# Altium project Transmitter.PrjPcb
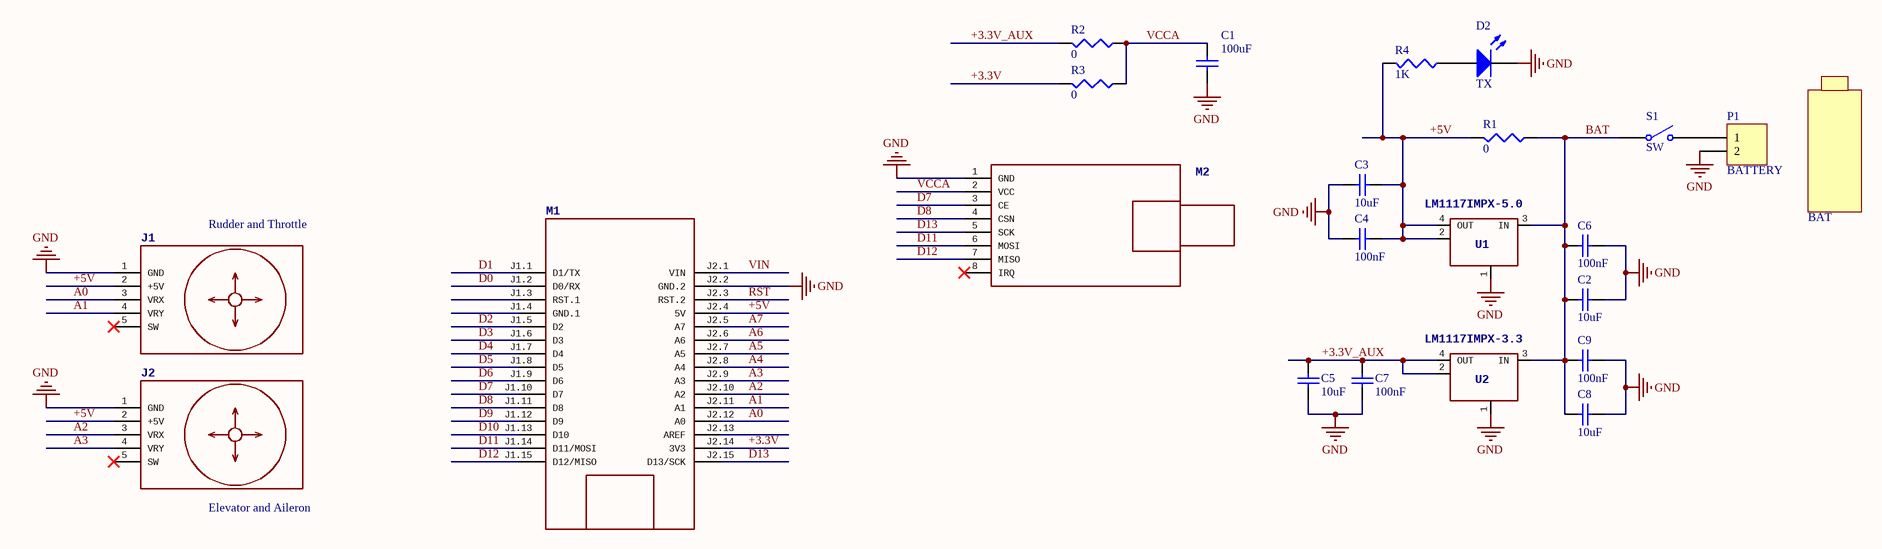
[diagram p0: Transmitter.SchDoc]
1 sheet, 23 parts. Net scope: global (net labels, ports and power ports of the same name join across sheets).
Board file: Transmitter.PcbDoc

## Sheet Transmitter.SchDoc
size A3

### Parts
BAT  BAT  [BAT]  (value not drawn)
C1  value 100uF  [CAPR5-4X5]  (hidden comment: Cap)
C2  value 10uF  [R1206]  (hidden comment: Cap)
C3  value 10uF  [R1206]  (hidden comment: Cap)
C4  value 100nF  [R1206]  (hidden comment: Cap)
C5  value 10uF  [R1206]  (hidden comment: Cap)
C6  value 100nF  [R1206]  (hidden comment: Cap)
C7  value 100nF  [R1206]  (hidden comment: Cap)
C8  value 10uF  [R1206]  (hidden comment: Cap)
C9  value 100nF  [R1206]  (hidden comment: Cap)
D2  TX  [R1206]
J1  <b>2-Axis Analog Joystick</b> with Push Button / <p>Tutorial is available here:<br /> / <a href="http://henrysbench.capnfatz.com/henrys-bench/arduino-sensors-and-input/arduino-ps2-joystick-tutorial-keyes-ky-023-deek-robot/">http://henrysbench.capnfatz.com/henrys-bench/arduino-sensors-and-input/arduino-ps2-joystick-tutorial-keyes-ky-023-deek-robot/</a></p> / <p><b><a href="http://www.ebay.com/sch/joystick+ps2+module">Click here to find device on ebay.com</a></b></p> / <p><img alt="photo" src="http://www.diymodules.org/img/device-photo.php?name=JOYSTICK-2AXIS-BUTTON"></p>  [JOYSTICK-2AXIS-BUTTON]  (value not drawn)
J2  <b>2-Axis Analog Joystick</b> with Push Button / <p>Tutorial is available here:<br /> / <a href="http://henrysbench.capnfatz.com/henrys-bench/arduino-sensors-and-input/arduino-ps2-joystick-tutorial-keyes-ky-023-deek-robot/">http://henrysbench.capnfatz.com/henrys-bench/arduino-sensors-and-input/arduino-ps2-joystick-tutorial-keyes-ky-023-deek-robot/</a></p> / <p><b><a href="http://www.ebay.com/sch/joystick+ps2+module">Click here to find device on ebay.com</a></b></p> / <p><img alt="photo" src="http://www.diymodules.org/img/device-photo.php?name=JOYSTICK-2AXIS-BUTTON"></p>  [JOYSTICK-2AXIS-BUTTON]  (value not drawn)
M1  <b>Arduino Nano 3.0</b> and compatible devices / <p>More details available here:<br> / <a href="https://www.arduino.cc/en/Main/ArduinoBoardNano">https://www.arduino.cc/en/Main/ArduinoBoardNano</a></p> / <p><b><a href="http://www.ebay.com/sch/arduino+nano">Click here to find device on ebay.com</a></b></p> / <p><img alt="photo" src="http://www.diymodules.org/img/device-photo.php?name=ARDUINO-NANO-3.0"></p>  [ARDUINO-NANO-3.0]  (value not drawn)
M2  <b>2.4 GHz Wireless Module</b> based on <b>NRF24L01</b> chip with preamplifier and external antenna / <p><b><a href="http://www.ebay.com/sch/nrf24l01+pa+lna+sma">Click here to find device on ebay.com</a></b></p> / <p><img alt="photo" src="http://www.diymodules.org/img/device-photo.php?name=WIRELESS-NRF24L01-PA-EXT"></p>  [WIRELESS-NRF24L01-PA-EXT]  (value not drawn)
P1  BATTERY  [HDR1X2]
R1  0  [R1206]
R2  0  [R1206]
R3  0  [R1206]
R4  1K  [R1206]
S1  SW  [KEY]
U1  LM1117IMPX-5.0  [LINEAR_SOT223]
U2  LM1117IMPX-3.3  [LINEAR_SOT223]

### Nets
GND: C1.2 C2.2 C3.2 C4.2 C5.2 C6.2 C7.1 C8.1 C9.1 D2.2(K) J1.1(GND) J2.1(GND) M1.J2.2(GND.2) M2.1(GND) P1.2 U1.1(GND/ADJ) U2.1(GND/ADJ)
+3.3V: M1.J2.14(3V3) R3.2
+3.3V_AUX: C5.1 C7.2 R2.2 U2.2(OUT) U2.4(OUT)
+5V: C3.1 C4.1 J1.2(+5V) J2.2(+5V) M1.J2.4(5V) R1.2 R4.2 U1.2(OUT) U1.4(OUT)
A0: J1.3(VRX) M1.J2.12(A0)
A1: J1.4(VRY) M1.J2.11(A1)
A2: J2.3(VRX) M1.J2.10(A2)
A3: J2.4(VRY) M1.J2.9(A3)
A4: M1.J2.8(A4)
A5: M1.J2.7(A5)
A6: M1.J2.6(A6)
A7: M1.J2.5(A7)
BAT: C2.1 C6.1 C8.2 C9.2 R1.1 S1.1(COMMON) U1.3(IN) U2.3(IN)
D0: M1.J1.2(D0/RX)
D1: M1.J1.1(D1/TX)
D2: M1.J1.5(D2)
D3: M1.J1.6(D3)
D4: M1.J1.7(D4)
D5: M1.J1.8(D5)
D6: M1.J1.9(D6)
D7: M1.J1.10(D7) M2.3(CE)
D8: M1.J1.11(D8) M2.4(CSN)
D9: M1.J1.12(D9)
D10: M1.J1.13(D10)
D11: M1.J1.14(D11/MOSI) M2.6(MOSI)
D12: M1.J1.15(D12/MISO) M2.7(MISO)
D13: M1.J2.15(D13/SCK) M2.5(SCK)
RST: M1.J2.3(RST.2)
VCCA: C1.1 M2.2(VCC) R2.1 R3.1
VIN: M1.J2.1(VIN)
NetD2_1: D2.1(A) R4.1
NetP1_1: P1.1 S1.2(NO)

Not connected (* = marked no-connect by the designer): J1 5(SW)*; J2 5(SW)*; M1 J1.3(RST.1) J1.4(GND.1) J2.13(AREF); M2 8(IRQ)*

### Notes on the sheet
- Rudder and Throttle
- Elevator and Aileron

### Library data of the parts
C1-C9 = Cap: Capacitor; Published: 8-Jun-2000; LatestRevisionDate: 17-Jul-2002; LatestRevisionNote: Re-released for DXP Platform.; PackageReference: RAD-0.3; Publisher: Altium Limited; PackageDescription: Radial Cap, Thru-Hole; 2 Leads; 0.3 in Pin Spacing
D2 = LED0: Typical INFRARED GaAs LED; Published: 8-Jun-2000; LatestRevisionDate: 08-Jul-2005; LatestRevisionNote: Mech Layer 1 removed.; PackageReference: LED-0; Publisher: Altium Limited; PackageDescription: LED; 2 Leads
J1 J2 = JOYSTICK-2AXIS-BUTTON
M1 = ARDUINO-NANO-3.0
M2 = WIRELESS-NRF24L01-PA-EXT
P1 = Header 2: Header, 2-Pin; LatestRevisionDate: 17-Jul-2002; LatestRevisionNote: Re-released for DXP Platform.; Publisher: Altium Limited
R1-R4 = R_SM_1206: RJ-1206-; Value: 120 ohm
S1 = SW-SPST: Single-Pole, Single-Throw Switch; Published: 24-Mar-1999; LatestRevisionDate: 17-Jul-2002; LatestRevisionNote: Re-released for DXP Platform.; PackageReference: SPST-2; Publisher: Altium Limited; PackageDescription: Switch; 2 Leads
U1 U2 = 0022_LM1117IMPX-5.0: Low-dropout linear regulator 5V  -LM1117IMPX-5.0